# Altium schematic sheet STM32_FYP_DAC_Module.SchDoc
size A3; Organization: Altium Limited; Address1: L3, 12a Rodborough Rd; Address2: Frenchs Forest; Address3: NSW; Address4: Australia 2086
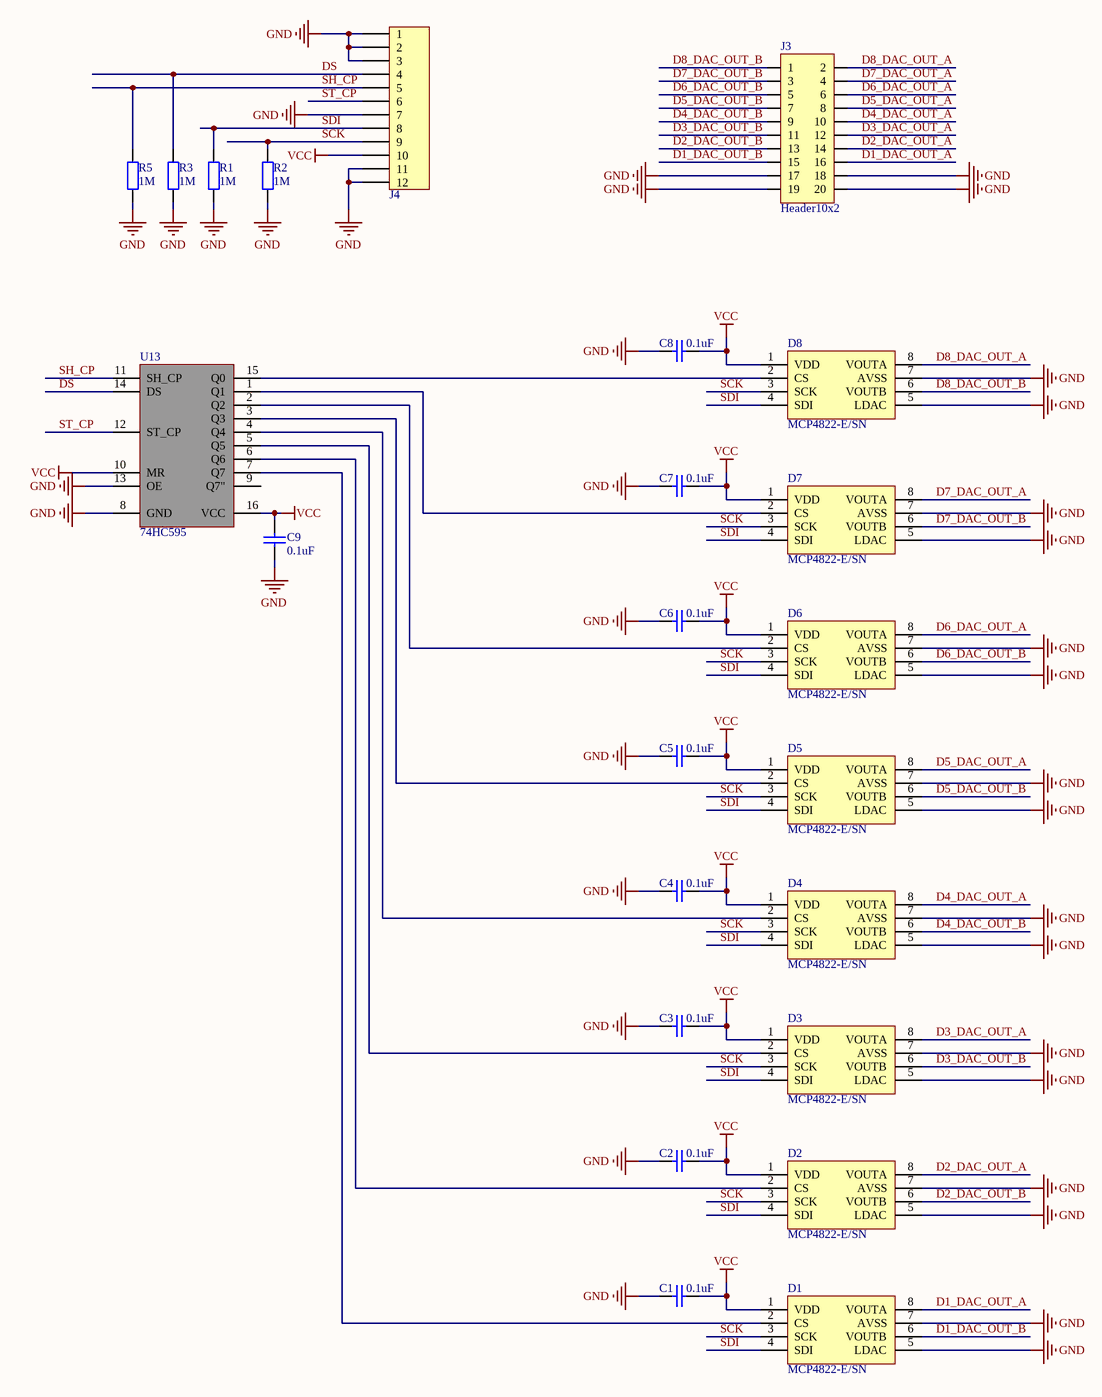
[diagram p0: STM32_FYP_DAC_Module.SchDoc]

## Parts
C1  0.1uF  [0805C_M]
C2  0.1uF  [0805C_M]
C3  0.1uF  [0805C_M]
C4  0.1uF  [0805C_M]
C5  0.1uF  [0805C_M]
C6  0.1uF  [0805C_M]
C7  0.1uF  [0805C_M]
C8  0.1uF  [0805C_M]
C9  0.1uF  [0805C_M]
D1  MCP4822-E/SN  [SOIC-8_150mil]
D2  MCP4822-E/SN  [SOIC-8_150mil]
D3  MCP4822-E/SN  [SOIC-8_150mil]
D4  MCP4822-E/SN  [SOIC-8_150mil]
D5  MCP4822-E/SN  [SOIC-8_150mil]
D6  MCP4822-E/SN  [SOIC-8_150mil]
D7  MCP4822-E/SN  [SOIC-8_150mil]
D8  MCP4822-E/SN  [SOIC-8_150mil]
J3  Header10x2  [10PX2-2.54 - H]
J4  Header12  [12P-2.54-H]  (value not drawn)
R1  1M  [0805R_M]
R2  1M  [0805R_M]
R3  1M  [0805R_M]
R5  1M  [0805R_M]
U13  74HC595  [SOIC-16_150mil]

## Nets
GND: C1.1 C2.1 C3.1 C4.1 C5.1 C6.1 C7.1 C8.1 C9.1 D1.5(LDAC) D1.7(AVSS) D2.5(LDAC) D2.7(AVSS) D3.5(LDAC) D3.7(AVSS) D4.5(LDAC) D4.7(AVSS) D5.5(LDAC) D5.7(AVSS) D6.5(LDAC) D6.7(AVSS) D7.5(LDAC) D7.7(AVSS) D8.5(LDAC) D8.7(AVSS) J3.17 J3.18 J3.19 J3.20 J4.1 J4.2 J4.3 J4.7 J4.11 J4.12 R1.1 R2.1 R3.1 R5.1 U13.8(GND) U13.13(OE)
VCC: C1.2 C2.2 C3.2 C4.2 C5.2 C6.2 C7.2 C8.2 C9.2 D1.1(VDD) D2.1(VDD) D3.1(VDD) D4.1(VDD) D5.1(VDD) D6.1(VDD) D7.1(VDD) D8.1(VDD) J4.10 U13.10(MR) U13.16(VCC)
D1_DAC_OUT_A: D1.8(VOUTA) J3.16
D1_DAC_OUT_B: D1.6(VOUTB) J3.15
D2_DAC_OUT_A: D2.8(VOUTA) J3.14
D2_DAC_OUT_B: D2.6(VOUTB) J3.13
D3_DAC_OUT_A: D3.8(VOUTA) J3.12
D3_DAC_OUT_B: D3.6(VOUTB) J3.11
D4_DAC_OUT_A: D4.8(VOUTA) J3.10
D4_DAC_OUT_B: D4.6(VOUTB) J3.9
D5_DAC_OUT_A: D5.8(VOUTA) J3.8
D5_DAC_OUT_B: D5.6(VOUTB) J3.7
D6_DAC_OUT_A: D6.8(VOUTA) J3.6
D6_DAC_OUT_B: D6.6(VOUTB) J3.5
D7_DAC_OUT_A: D7.8(VOUTA) J3.4
D7_DAC_OUT_B: D7.6(VOUTB) J3.3
D8_DAC_OUT_A: D8.8(VOUTA) J3.2
D8_DAC_OUT_B: D8.6(VOUTB) J3.1
DS: J4.4 R3.2 U13.14(DS)
SCK: D1.3(SCK) D2.3(SCK) D3.3(SCK) D4.3(SCK) D5.3(SCK) D6.3(SCK) D7.3(SCK) D8.3(SCK) J4.9 R2.2
SDI: D1.4(SDI) D2.4(SDI) D3.4(SDI) D4.4(SDI) D5.4(SDI) D6.4(SDI) D7.4(SDI) D8.4(SDI) J4.8 R1.2
SH_CP: J4.5 R5.2 U13.11(SH_CP)
ST_CP: J4.6 U13.12(ST_CP)
NetD1_2: D1.2(CS) U13.7(Q7)
NetD2_2: D2.2(CS) U13.6(Q6)
NetD3_2: D3.2(CS) U13.5(Q5)
NetD4_2: D4.2(CS) U13.4(Q4)
NetD5_2: D5.2(CS) U13.3(Q3)
NetD6_2: D6.2(CS) U13.2(Q2)
NetD7_2: D7.2(CS) U13.1(Q1)
NetD8_2: D8.2(CS) U13.15(Q0)

Not connected (* = marked no-connect by the designer): U13 9(Q7")

## Notes on the sheet
- Title
- Size:
- Date:
- A3
- Number:
- Time:
- Revision:
- Sheet
- of
- File:

## Library data of the parts
C1-C9 = Cap: 无极性电容; Published: 8-Jun-2000; LatestRevisionDate: 17-Jul-2002; LatestRevisionNote: Re-released for DXP Platform.; PackageReference: RAD-0.3; Publisher: Altium Limited; PackageDescription: Radial Cap, Thru-Hole; 2 Leads; 0.3 in Pin Spacing; Value: 0.1uF
D1-D8 = MCP4822: DAC数模转换芯片
J4 = Header12: 12PIN插座
R1-R3 R5 = Res: 电阻; Published: 8-Jun-2000; LatestRevisionDate: 17-Jul-2002; LatestRevisionNote: Re-released for DXP Platform.; PackageReference: AXIAL-0.4; Publisher: Altium Limited; PackageDescription: Axial Device, Thru-Hole; 2 Leads; 0.4 in Pin Spacing
U13 = 74LS595: 移位寄存器